# EAGLE schematic Flodar_Board_V1-1 (EAGLE 9.6.2)
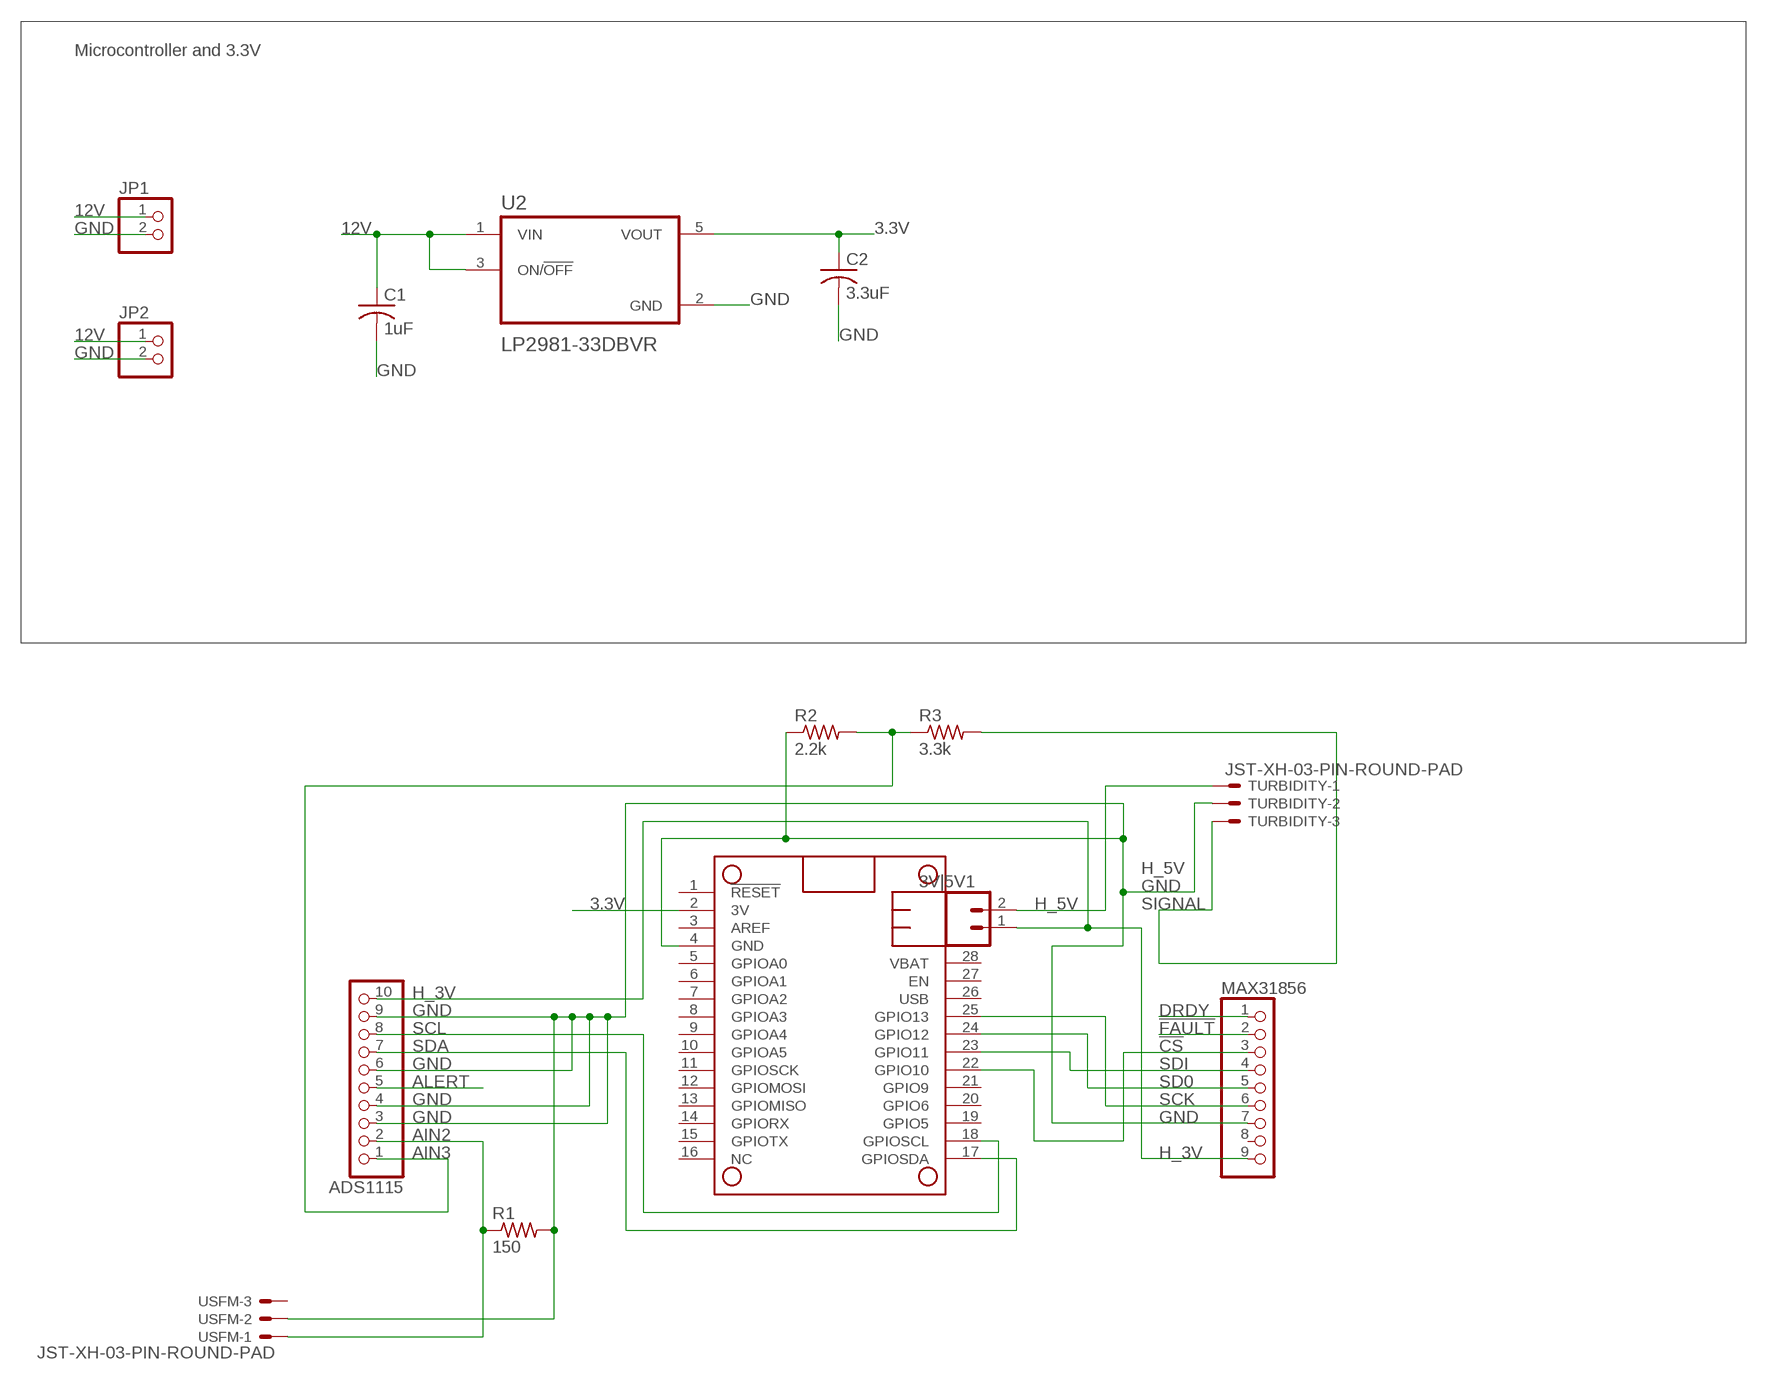
[diagram p0: schematic, sheet 1]

## Parts
3V|5V1  CONN_021X02_NO_SILK  [1X02_NO_SILK]
ADS1115  HEADER-1X1070MIL  [1X10_ROUND70]
C1  1uF  C-USC1206  [C1206]
C2  3.3uF  C-USC1206  [C1206]
JP1  PINHD-1X2  [1X02]
JP2  PINHD-1X2  [1X02]
MAX31856  HEADER-1X970MIL  [1X09_ROUND_70]
MS3  FEATHERWING  [FEATHERWING]
R1  150  R-US_R1206  [R1206]
R2  2.2k  R-US_R1206  [R1206]
R3  3.3k  R-US_R1206  [R1206]
TURBIDITY  JST-XH-03-PIN-ROUND-PAD  [JST-XH-03-PACKAGE-ROUND-PAD]
U2  LP2981-33DBVR  LP2981-50DBVR  [SOT95P280X145-5N]
USFM  JST-XH-03-PIN-ROUND-PAD  [JST-XH-03-PACKAGE-ROUND-PAD]

## Nets
3.3V: C2.1 MS3.2(3V) U2.5(VOUT)
12V: C1.1 JP1.1 JP2.1 U2.1(VIN) U2.3(ON/!OFF)
!CS: MAX31856.3 MS3.22(GPIO10)
!FAULT: MAX31856.2
AIN2: ADS1115.2 R1.1 USFM.1
AIN3: ADS1115.1 R2.2 R3.1
ALERT: ADS1115.5
DRDY: MAX31856.1
GND: ADS1115.3 ADS1115.4 ADS1115.6 ADS1115.9 C1.2 C2.2 JP1.2 JP2.2 MAX31856.7 MS3.4(GND) R1.2 R2.1 TURBIDITY.2 U2.2(GND) USFM.2
H_3V: 3V|5V1.1 ADS1115.10 MAX31856.9
H_5V: 3V|5V1.2 TURBIDITY.1
SCK: MAX31856.6 MS3.25(GPIO13)
SCL: ADS1115.8 MS3.18(GPIOSCL)
SD0: MAX31856.5 MS3.24(GPIO12)
SDA: ADS1115.7 MS3.17(GPIOSDA)
SDI: MAX31856.4 MS3.23(GPIO11)
SIGNAL: R3.2 TURBIDITY.3
Unconnected: MAX31856.8 MS3.1(!RESET) MS3.3(AREF) MS3.5(GPIOA0) MS3.6(GPIOA1) MS3.7(GPIOA2) MS3.8(GPIOA3) MS3.9(GPIOA4) MS3.10(GPIOA5) MS3.11(GPIOSCK) MS3.12(GPIOMOSI) MS3.13(GPIOMISO) MS3.14(GPIORX) MS3.15(GPIOTX) MS3.16(NC) MS3.19(GPIO5) MS3.20(GPIO6) MS3.21(GPIO9) MS3.26(USB) MS3.27(EN) MS3.28(VBAT) USFM.3

## Notes on the sheet
- Microcontroller and 3.3V

## Library data of the parts
3V|5V1 = SparkFun-Connectors:CONN_02: Multi connection point. Often used as Generic Header-pin footprint for 0.1 inch spaced/style header connections On any of the 0.1 inch spaced packages, you can populate with these: Break Away Headers - Straight <https://www.sparkfun.com/products/116> (PRT-00116) Break Away Male Headers - Right Angle <https://www.sparkfun.com/products/553> (PRT-00553) Female Headers <https://www.sparkfun.com/products/115> (PRT-00115) Break Away Headers - Machine Pin <https://www.sparkfun.com/products/117> (PRT-00117) Break Away Female Headers - Swiss Machine Pin <https://www.sparkfun.com/products/743> (PRT-00743) For SCREWTERMINALS and SPRING TERMINALS visit here: Screw Terimnals on SparkFun.com <https://www.sparkfun.com/search/results?term=Screw+Terminals> (5mm/3.5mm/2.54mm spacing) This device is also useful as a general connection point to wire up your design to another part of your project. Our various solder wires solder well into these plated through hole pads. Hook-Up Wire - Assortment (Stranded, 22 AWG) <https://www.sparkfun.com/products/11375> (PRT-11375) Hook-Up Wire - Assortment (Solid Core, 22 AWG) <https://www.sparkfun.com/products/11367> (PRT-11367) View the entire wire category on our website here <https://www.sparkfun.com/categories/141> Special notes: Molex polarized connector foot print use with: PRT-08233 with associated crimp pins and housings. 2.54_SCREWTERM for use with PRT-10571. 3.5mm Screw Terminal footprints for PRT-08084 5mm Screw Terminal footprints for use with PRT-08432
ADS1115 = microbuilder:HEADER-1X10: PIN HEADER
C1 C2 = rcl:C-US: CAPACITOR, American symbol; SPICEPREFIX: C
JP1 JP2 = pinhead:PINHD-1X2: PIN HEADER
MAX31856 = microbuilder:HEADER-1X9: PIN HEADER
MS3 = adafruit_wing:FEATHERWING
R1-R3 = adafruit:R-US_: RESISTOR, American symbol
TURBIDITY USFM = Rembrandt Electronics - JST XH Connectors v1-0:JST-XH-03-PIN: JST XH Connector 2 Pin Wire to board connector. Pitch: 2,54 mm, (0.100") Number of pins: 3 Created by Rembrandt Electronics www.rembrandtelectronics.com
U2 = LP2981-33DBVR:LP2981-50DBVR: Check prices <https://pricing.snapeda.com/parts/LP2981-50DBVR/Texas%20Instruments/view-part?ref=eda>; AVAILABILITY: In Stock; DESCRIPTION: 100-mA, 16-V, low-dropout voltage regulator with enable 5-SOT-23 -40 to 125; MF: Texas Instruments; MP: LP2981-50DBVR; PACKAGE: SOT-23-5 Texas Instruments; PRICE: None; PURCHASE-URL: https://pricing.snapeda.com/search/part/LP2981-50DBVR/?ref=eda